# EAGLE design conector_driver (EAGLE 6.1)
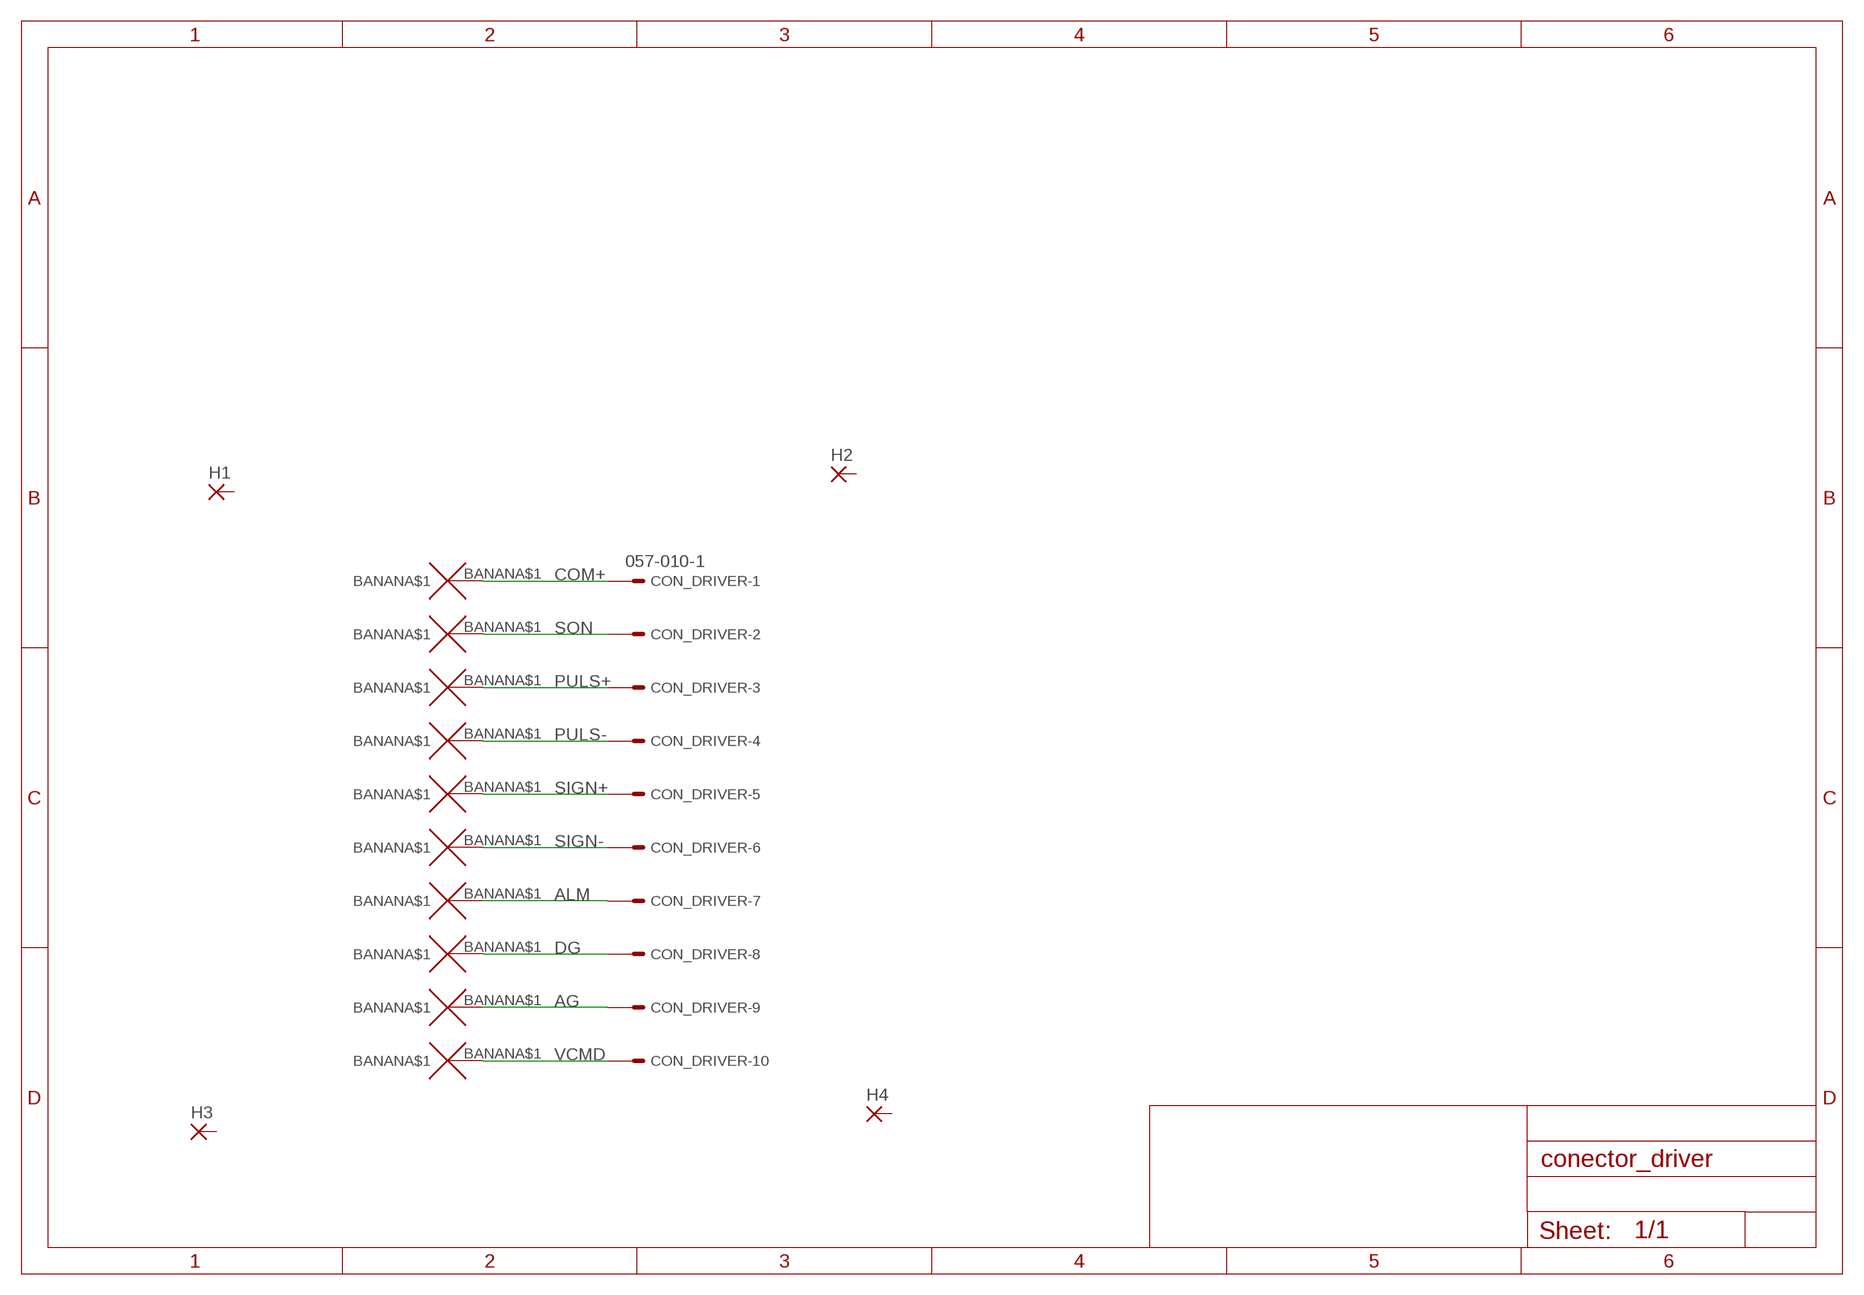
[diagram p0: schematic, sheet 1]

## Parts
AG  BANANA  [BANANA]
ALM  BANANA  [BANANA]
COM+  BANANA  [BANANA]
CON_DRIVER  057-010-1  [057-010-1]
DG  BANANA  [BANANA]
H1  3,81/1,4  [3,81/1,4]
H2  3,81/1,4  [3,81/1,4]
H3  3,81/1,4  [3,81/1,4]
H4  3,81/1,4  [3,81/1,4]
PULS+  BANANA  [BANANA]
PULS-  BANANA  [BANANA]
SIGN+  BANANA  [BANANA]
SIGN-  BANANA  [BANANA]
SON  BANANA  [BANANA]
VCMD  BANANA  [BANANA]

## Nets
AG: AG.BANANA$1 CON_DRIVER.9
ALM: ALM.BANANA$1 CON_DRIVER.7
COM+: COM+.BANANA$1 CON_DRIVER.1
DG: CON_DRIVER.8 DG.BANANA$1
PULS+: CON_DRIVER.3 PULS+.BANANA$1
PULS-: CON_DRIVER.4 PULS-.BANANA$1
SIGN+: CON_DRIVER.5 SIGN+.BANANA$1
SIGN-: CON_DRIVER.6 SIGN-.BANANA$1
SON: CON_DRIVER.2 SON.BANANA$1
VCMD: CON_DRIVER.10 VCMD.BANANA$1
Unconnected: H1.1(P) H2.1(P) H3.1(P) H4.1(P)

## Library data of the parts
AG ALM COM+ DG PULS+ PULS- SIGN+ SIGN- SON VCMD = wirepad:BANANA
CON_DRIVER = con-panduit:057-010-: CONNECTOR 10-pin series 057 contact pc board low profile headers; OC_FARNELL: unknown; OC_NEWARK: unknown
H1-H4 = wirepad:3,81/1,4: THROUGH-HOLE PAD

## Board
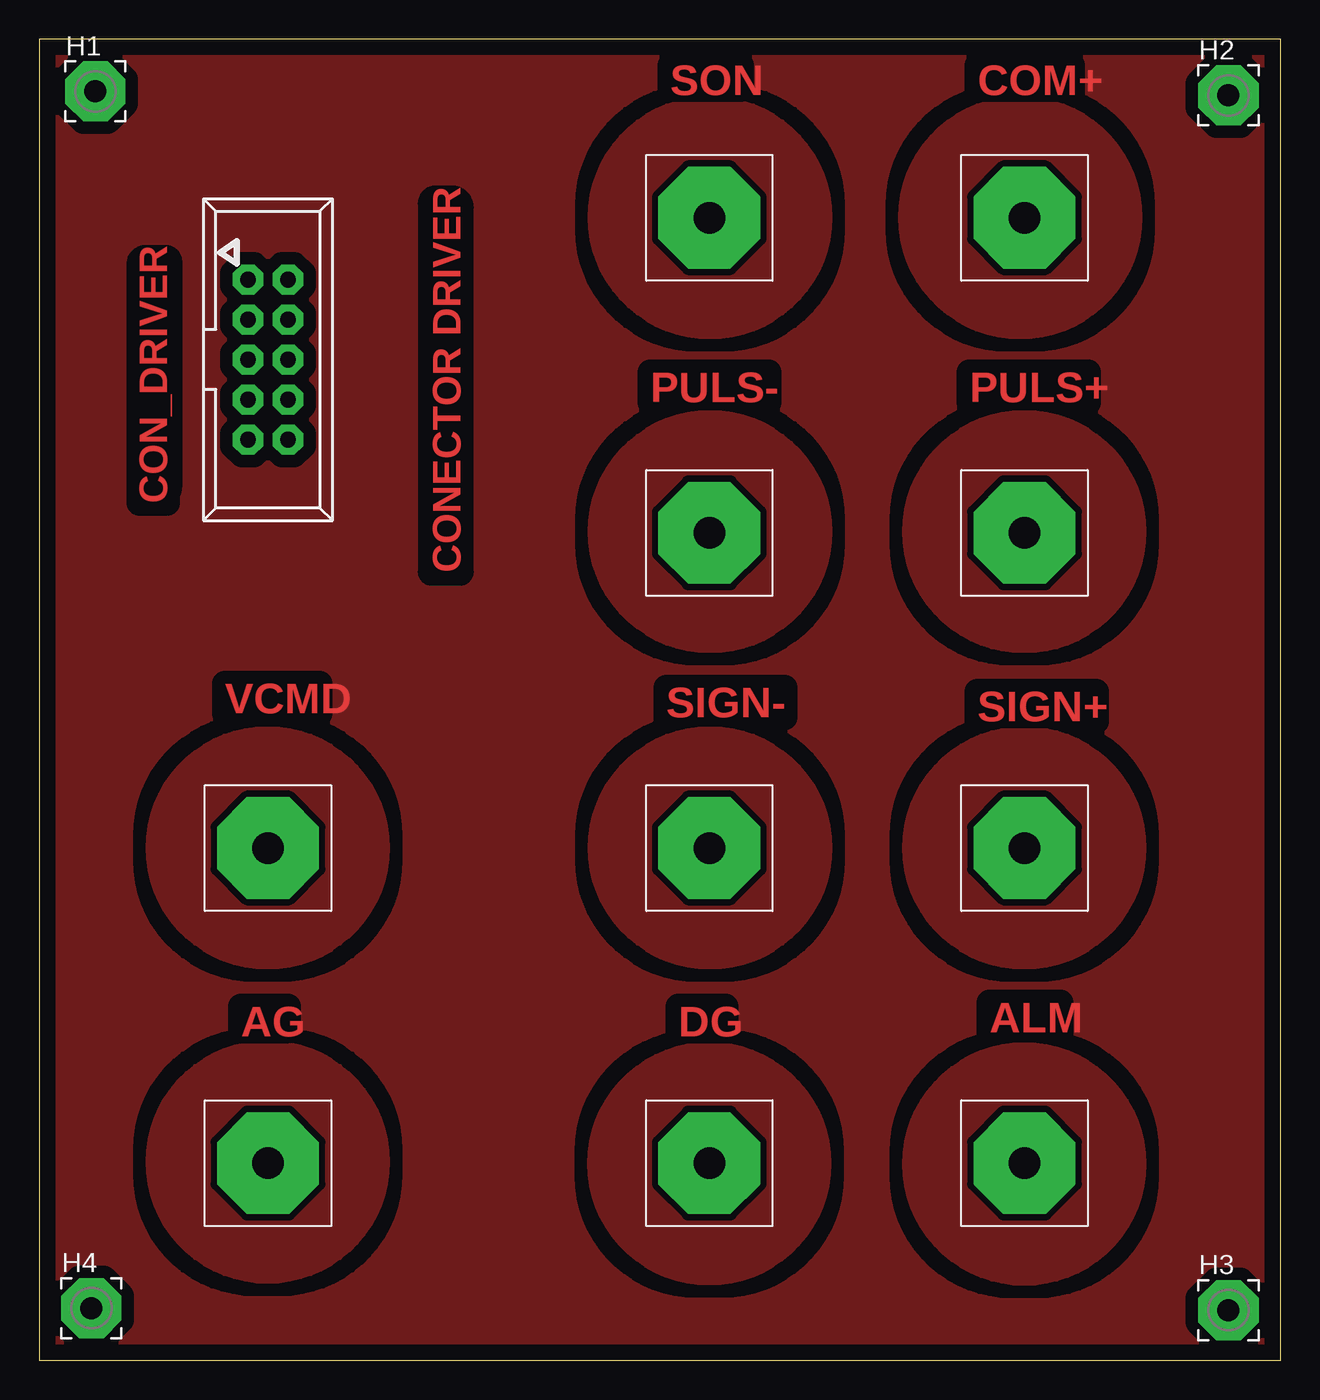
[diagram p1: board, top side]
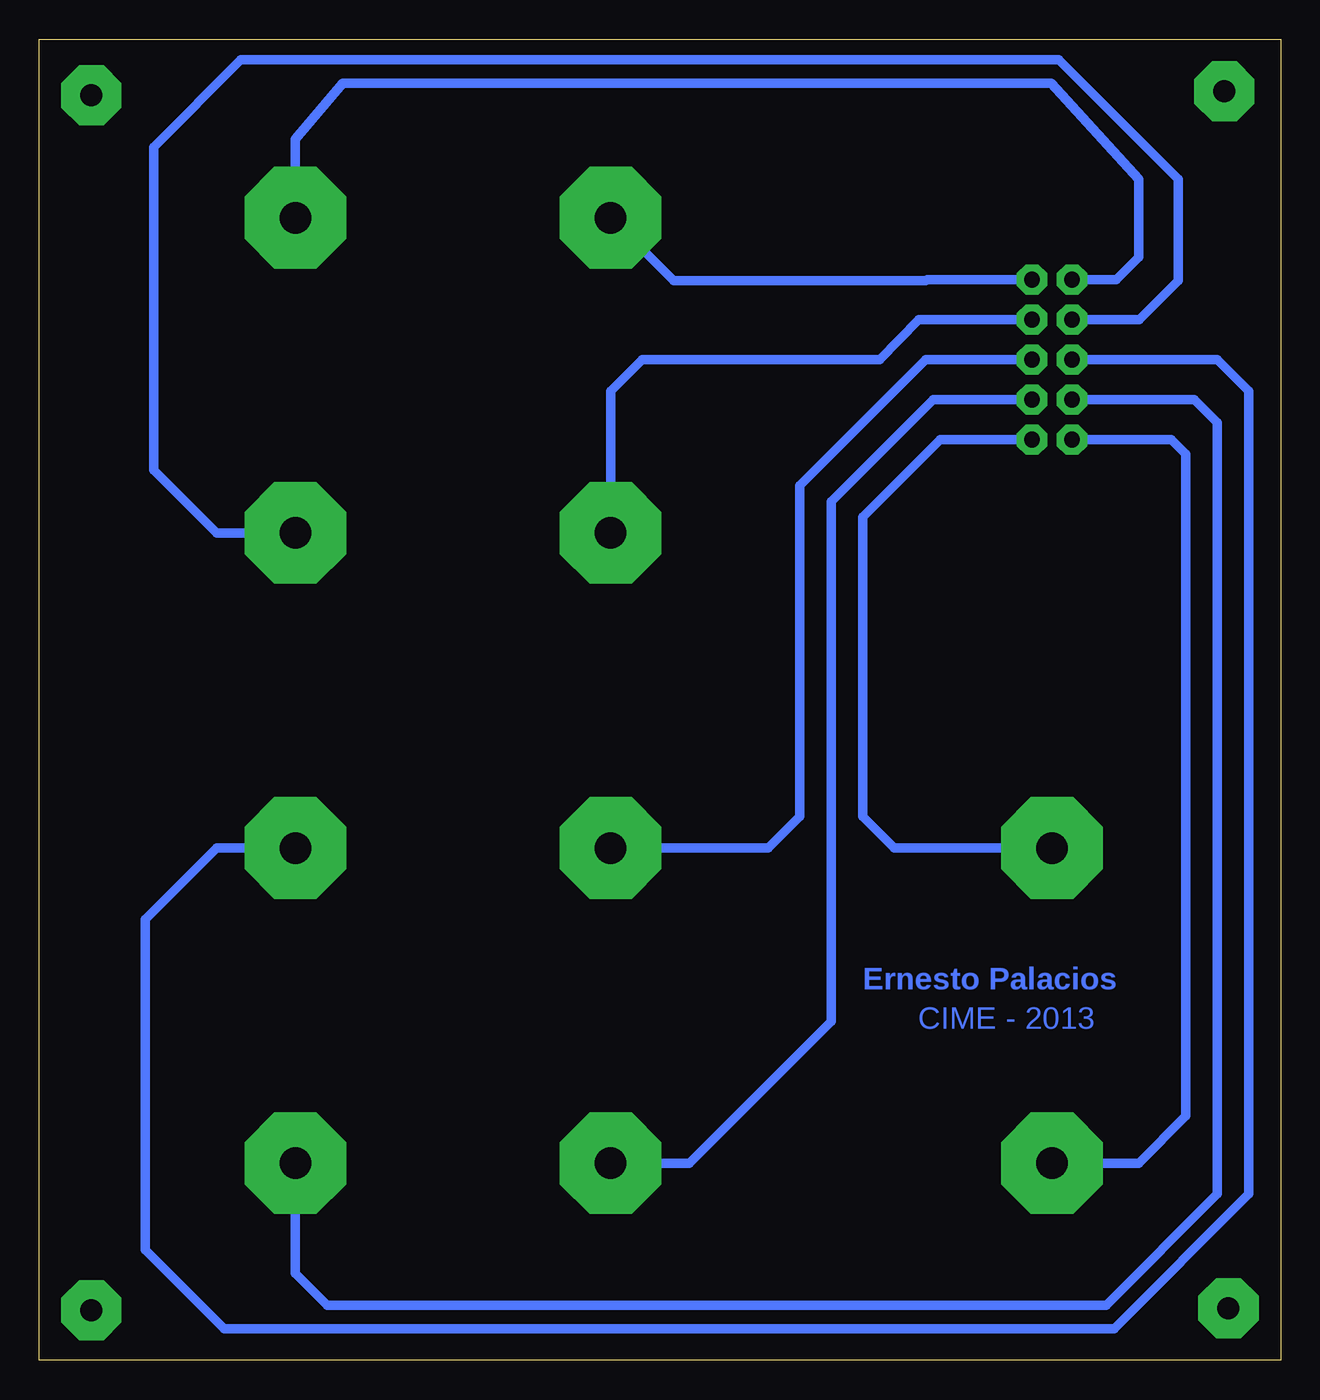
[diagram p2: board, bottom side, seen from below]

Size 78.74 x 83.82 mm. Coordinates in mm from the lower left corner, seen from the top.
Outline: 0,0 78.74,0 78.74,83.82 0,83.82 0,0
Copper layers (1*16): Top 0.035mm / dielectric 1.5mm / Bottom 0.035mm
Design rules: minimum track width 10mil, minimum drill 24mil, track to track 16mil, track to pad 16mil, pad to pad 16mil, via to via 16mil, smd to smd 16mil, copper to edge 40mil, drill to drill 8mil, minimum pad ring 18mil, minimum via ring 8mil, stop-mask expansion 4mil, vias tented up to drill 0mil, thermal gap 10mil

### Footprints (pad centres in the part's own frame; a part is rotated, then mirrored left to right if it is on the bottom)
BANANA = drill 2 pad 6.452 octagon: BANANA$1 0,0
057-010-1 = drill 1 octagon: 1 -5.08,-1.27; 2 -5.08,1.27; 3 -2.54,-1.27; 4 -2.54,1.27; 5 0,-1.27; 6 0,1.27; 7 2.54,-1.27; 8 2.54,1.27; 9 5.08,-1.27; 10 5.08,1.27
3,81/1,4 = drill 1.397 pad 3.81 octagon: 1 0,0

### Placement (x,y rotation side)
AG  14.5,12.5 0 top
ALM  62.5,12.5 0 top
COM+  62.5,72.5 0 top
CON_DRIVER  14.5,63.5 270 top
DG  42.5,12.5 0 top
H1  3.56,80.52 0 top
H2  75.44,80.26 0 top
H3  75.44,3.17 0 top
H4  3.3,3.3 0 top
PULS+  62.5,52.5 0 top
PULS-  42.5,52.5 0 top
SIGN+  62.5,32.5 0 top
SIGN-  42.5,32.5 0 top
SON  42.5,72.5 0 top
VCMD  14.5,32.5 0 top

### Tracks (layer width: path | path; a pad name or v marks a point on that pad's centre or on a via)
AG
  Bottom 0.61: CON_DRIVER.9 6.92,58.42 6,57.5 6,15.5 9,12.5 AG.BANANA$1
ALM
  Bottom 0.61: CON_DRIVER.7 5.46,60.96 4,59.5 4,10.54 11.05,3.49 60.49,3.49 62.5,5.5 ALM.BANANA$1
COM+
  Bottom 0.61: CON_DRIVER.1 10.42,68.58 9,70 9,74.96 14.56,81.02 59.48,81.02 62.5,77.5 COM+.BANANA$1
DG
  Bottom 0.61: CON_DRIVER.8 22.04,60.96 28.5,54.5 28.5,21.5 37.5,12.5 DG.BANANA$1
N$1
  pour Top (isolate 0.813, rank 3): 0,0 78.74,0 78.74,83.57 0,83.57
N$2
  pour Top: 14.48,40.13 arc-90 22.1,32.51 arc-90 14.48,24.89 arc-90 6.86,32.51 arc-90
N$3
  pour Top: 14.48,20.19 arc-90 22.1,12.57 arc-90 14.48,4.95 arc-90 6.86,12.57 arc-90
N$4
  pour Top: 42.49,20.09 arc-90 50.11,12.47 arc-90 42.49,4.85 arc-90 34.87,12.47 arc-90
N$5
  pour Top: 62.48,20.07 arc-90 70.1,12.45 arc-90 62.48,4.83 arc-90 54.86,12.45 arc-90
N$6
  pour Top: 42.55,40.13 arc-90 50.16,32.51 arc-90 42.55,24.89 arc-90 34.93,32.51 arc-90
N$7
  pour Top: 62.48,40.13 arc-90 70.1,32.51 arc-90 62.48,24.89 arc-90 54.86,32.51 arc-90
N$8
  pour Top: 42.55,60.2 arc-90 50.16,52.58 arc-90 42.55,44.96 arc-90 34.93,52.58 arc-90
N$9
  pour Top: 62.48,60.2 arc-90 70.1,52.58 arc-90 62.48,44.96 arc-90 54.86,52.58 arc-90
N$10
  pour Top: 42.55,80.14 arc-90 50.16,72.52 arc-90 42.55,64.9 arc-90 34.93,72.52 arc-90
N$11
  pour Top: 62.23,80.14 arc-90 69.85,72.52 arc-90 62.23,64.9 arc-90 54.61,72.52 arc-90
N$12
  cutout Top: 24.13,73.41 24.13,50.04 arc90 24.89,49.28 26.67,49.28 arc90 27.43,50.04 27.43,73.15 arc90 26.16,74.42 25.15,74.42 arc90
N$13
  cutout Top (isolate 0.254): 7.99,70.49 6.74,70.49 arc90 5.84,69.59 5.84,55.27 arc90 7.01,54.1 7.37,54.1 arc90 8.76,55.5 8.76,69.71 arc90
PULS+
  Bottom 0.61: CON_DRIVER.3 8.96,66.04 6.5,68.5 6.5,74.94 14.07,82.52 65.96,82.52 71.5,76.98 71.5,56.5 67.5,52.5 PULS+.BANANA$1
PULS-
  Bottom 0.61: CON_DRIVER.4 22.96,66.04 25.42,63.5 40.5,63.5 42.5,61.5 PULS-.BANANA$1
SIGN+
  Bottom 0.61: CON_DRIVER.5 4,63.5 2,61.5 2,10.56 10.56,2 67,2 72.02,7.02 72.02,27.98 67.5,32.5 SIGN+.BANANA$1
SIGN-
  Bottom 0.61: CON_DRIVER.6 22.5,63.5 30.5,55.5 30.5,34.5 32.5,32.5 SIGN-.BANANA$1
SON
  Bottom 0.61: CON_DRIVER.2 22.42,68.58 22.5,68.5 38.5,68.5 SON.BANANA$1
VCMD
  Bottom 0.61: CON_DRIVER.10 21.58,58.42 26.5,53.5 26.5,34.5 24.5,32.5 VCMD.BANANA$1

### Text on the board
Top: CONECTOR DRIVER
Bottom: Ernesto Palacios | CIME - 2013